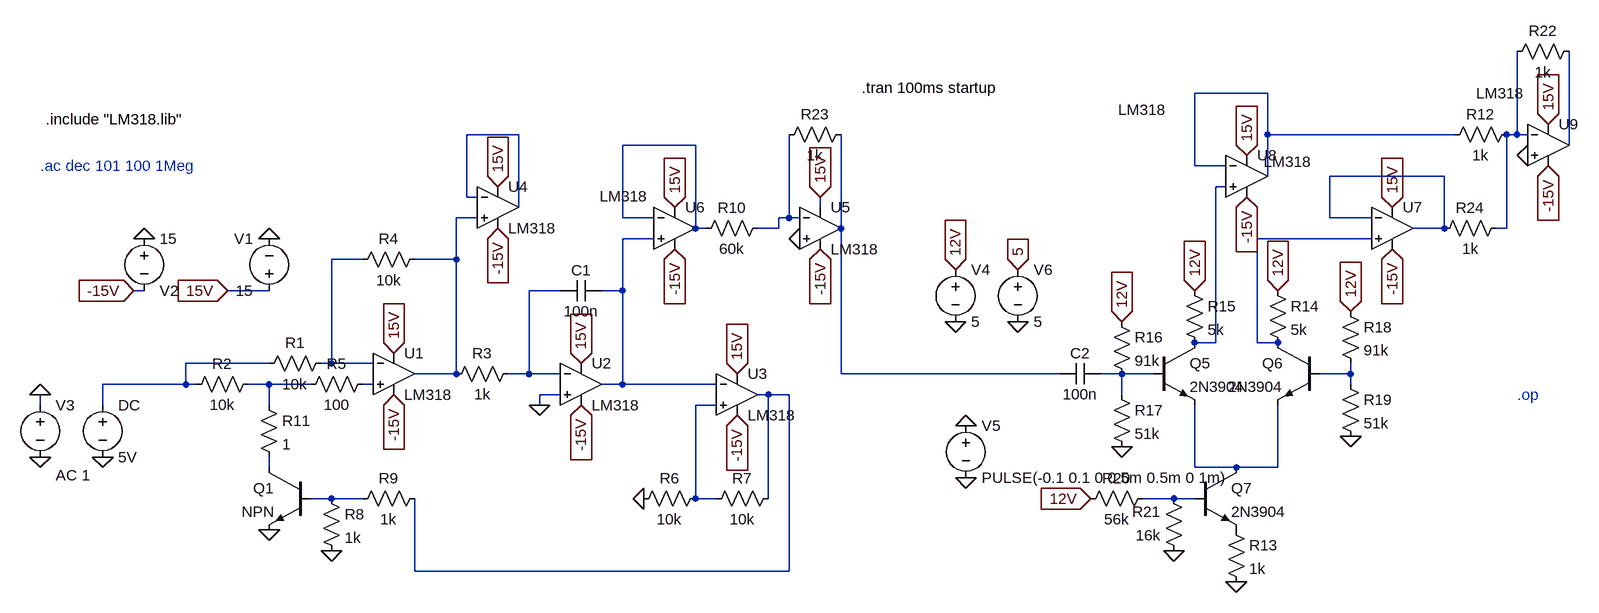
[diagram p0: schematic Draft5.asc]
Draft5.asc, the LTspice schematic file:
Version 4.1
SHEET 1 2740 720
WIRE 1472 -192 1360 -192
WIRE 320 -128 240 -128
WIRE 1472 -128 1472 -192
WIRE 1760 -128 1472 -128
WIRE 1856 -128 1856 -256
WIRE 1856 -128 1840 -128
WIRE 1872 -128 1856 -128
WIRE 592 -112 480 -112
WIRE 1936 -112 1936 -256
WIRE 1360 -80 1360 -192
WIRE 1408 -80 1360 -80
WIRE 1472 -64 1472 -128
WIRE 1744 -64 1568 -64
WIRE 1408 -48 1392 -48
WIRE 240 -32 240 -128
WIRE 256 -32 240 -32
WIRE 320 -16 320 -128
WIRE 784 -16 784 -32
WIRE 256 0 224 0
WIRE 480 0 480 -112
WIRE 528 0 480 0
WIRE 736 0 736 -128
WIRE 736 0 720 0
WIRE 752 0 736 0
WIRE 1568 0 1568 -64
WIRE 1632 0 1568 0
WIRE 592 16 592 -112
WIRE 608 16 592 16
WIRE 720 16 720 0
WIRE 720 16 688 16
WIRE 816 16 816 -128
WIRE 1744 16 1744 -64
WIRE 1744 16 1696 16
WIRE 1840 16 1840 -128
WIRE 1840 16 1824 16
WIRE 528 32 480 32
WIRE 1632 32 1456 32
WIRE 80 64 32 64
WIRE 224 64 224 0
WIRE 224 64 160 64
WIRE -256 112 -272 112
WIRE -64 112 -128 112
WIRE 384 112 336 112
WIRE 480 112 480 32
WIRE 480 112 448 112
WIRE 1392 192 1392 -48
WIRE 1392 192 1360 192
WIRE 1456 192 1456 32
WIRE 1488 192 1456 192
WIRE -64 224 -192 224
WIRE 32 224 32 64
WIRE 32 224 16 224
WIRE 96 224 32 224
WIRE 224 240 224 64
WIRE 224 240 160 240
WIRE 336 240 336 112
WIRE 336 240 304 240
WIRE 384 240 336 240
WIRE 816 240 816 16
WIRE 1152 240 816 240
WIRE 1248 240 1216 240
WIRE 1296 240 1248 240
WIRE 1600 240 1600 224
WIRE 1600 240 1552 240
WIRE -192 256 -192 224
WIRE -192 256 -320 256
WIRE -176 256 -192 256
WIRE -64 256 -96 256
WIRE 0 256 -64 256
WIRE 96 256 80 256
WIRE 480 256 480 112
WIRE 480 256 448 256
WIRE 624 256 480 256
WIRE 1600 256 1600 240
WIRE 384 272 352 272
WIRE 704 272 688 272
WIRE 736 272 704 272
WIRE 1248 272 1248 240
WIRE -416 288 -416 272
WIRE -320 288 -320 256
WIRE -64 288 -64 256
WIRE 352 288 352 272
WIRE 624 288 592 288
WIRE -64 384 -64 368
WIRE 1360 384 1360 288
WIRE 1424 384 1360 384
WIRE 1488 384 1488 288
WIRE 1488 384 1424 384
WIRE 32 432 0 432
WIRE 80 432 32 432
WIRE 592 432 592 288
WIRE 624 432 592 432
WIRE 704 432 704 272
WIRE 1328 432 1280 432
WIRE 1360 432 1328 432
WIRE 160 544 160 432
WIRE 736 544 736 272
WIRE 736 544 160 544
FLAG -128 112 15V
IOPIN -128 112 In
FLAG -272 112 -15V
IOPIN -272 112 In
FLAG -64 32 0
FLAG -256 32 0
FLAG 128 208 15V
IOPIN 128 208 In
FLAG 128 272 -15V
IOPIN 128 272 In
FLAG 416 288 -15V
IOPIN 416 288 In
FLAG 416 224 15V
IOPIN 416 224 In
FLAG 352 288 0
FLAG -64 480 0
FLAG 656 304 -15V
IOPIN 656 304 In
FLAG 512 432 0
FLAG 656 240 15V
IOPIN 656 240 In
FLAG -320 368 0
FLAG 32 512 0
FLAG -416 368 0
FLAG -416 272 0
FLAG 1424 560 0
FLAG 992 80 12V
IOPIN 992 80 In
FLAG 992 160 0
FLAG 1360 112 12V
IOPIN 1360 112 In
FLAG 1488 112 12V
IOPIN 1488 112 In
FLAG 1248 352 0
FLAG 1248 160 12V
IOPIN 1248 160 In
FLAG 1600 336 0
FLAG 1600 144 12V
IOPIN 1600 144 In
FLAG 1328 512 0
FLAG 1200 432 12V
IOPIN 1200 432 In
FLAG 1088 160 0
FLAG 752 32 0
FLAG 1088 80 5
IOPIN 1088 80 In
FLAG 560 48 -15V
IOPIN 560 48 In
FLAG 288 -48 15V
IOPIN 288 -48 In
FLAG 560 -16 15V
IOPIN 560 -16 In
FLAG 288 16 -15V
IOPIN 288 16 In
FLAG 784 48 -15V
IOPIN 784 48 In
FLAG 784 -32 15V
IOPIN 784 -32 In
FLAG 1008 400 0
FLAG 1440 -32 -15V
IOPIN 1440 -32 In
FLAG 1440 -96 15V
IOPIN 1440 -96 In
FLAG 1664 -16 15V
IOPIN 1664 -16 In
FLAG 1664 48 -15V
IOPIN 1664 48 In
FLAG 1008 320 0
FLAG 1904 -144 15V
IOPIN 1904 -144 In
FLAG 1904 -80 -15V
IOPIN 1904 -80 In
FLAG 1872 -96 0
SYMBOL OpAmps\\opamp2 128 176 R0
SYMATTR InstName U1
SYMATTR Value LM318
SYMBOL voltage -320 272 R0
SYMATTR InstName DC
SYMATTR Value 5V
SYMBOL res 32 208 R90
WINDOW 0 0 56 VBottom 2
WINDOW 3 32 56 VTop 2
SYMATTR InstName R1
SYMATTR Value 10k
SYMBOL res -80 240 R90
WINDOW 0 0 56 VBottom 2
WINDOW 3 32 56 VTop 2
SYMATTR InstName R2
SYMATTR Value 10k
SYMBOL res 176 48 R90
WINDOW 0 0 56 VBottom 2
WINDOW 3 32 56 VTop 2
SYMATTR InstName R4
SYMATTR Value 10k
SYMBOL cap 448 96 R90
WINDOW 0 0 32 VBottom 2
WINDOW 3 32 32 VTop 2
SYMATTR InstName C1
SYMATTR Value 100n
SYMBOL OpAmps\\opamp2 416 192 R0
SYMATTR InstName U2
SYMATTR Value LM318
SYMBOL res 320 224 R90
WINDOW 0 0 56 VBottom 2
WINDOW 3 32 56 VTop 2
SYMATTR InstName R3
SYMATTR Value 1k
SYMBOL voltage -64 128 R180
WINDOW 0 24 96 Left 2
WINDOW 3 24 16 Left 2
WINDOW 123 0 0 Left 0
WINDOW 39 0 0 Left 0
SYMATTR InstName V1
SYMATTR Value 15
SYMBOL voltage -256 16 R0
WINDOW 0 24 96 Left 2
WINDOW 3 24 16 Left 2
WINDOW 123 0 0 Left 0
WINDOW 39 0 0 Left 0
SYMATTR InstName V2
SYMATTR Value 15
SYMBOL res 96 240 R90
WINDOW 0 0 56 VBottom 2
WINDOW 3 32 56 VTop 2
SYMATTR InstName R5
SYMATTR Value 100
SYMBOL npn 0 384 M0
SYMATTR InstName Q1
SYMBOL OpAmps\\opamp2 656 208 R0
SYMATTR InstName U3
SYMATTR Value LM318
SYMBOL res 608 416 R90
WINDOW 0 0 56 VBottom 2
WINDOW 3 32 56 VTop 2
SYMATTR InstName R6
SYMATTR Value 10k
SYMBOL res 720 416 R90
WINDOW 0 0 56 VBottom 2
WINDOW 3 32 56 VTop 2
SYMATTR InstName R7
SYMATTR Value 10k
SYMBOL res 16 416 R0
SYMATTR InstName R8
SYMATTR Value 1k
SYMBOL res 176 416 R90
WINDOW 0 0 56 VBottom 2
WINDOW 3 32 56 VTop 2
SYMATTR InstName R9
SYMATTR Value 1k
SYMBOL voltage -416 272 R0
WINDOW 123 24 124 Left 2
WINDOW 39 0 0 Left 0
SYMATTR Value2 AC 1
SYMATTR InstName V3
SYMATTR Value ""
SYMBOL npn 1296 192 R0
SYMATTR InstName Q5
SYMATTR Value 2N3904
SYMBOL npn 1552 192 M0
SYMATTR InstName Q6
SYMATTR Value 2N3904
SYMBOL res 1408 464 R0
SYMATTR InstName R13
SYMATTR Value 1k
SYMBOL npn 1360 384 R0
SYMATTR InstName Q7
SYMATTR Value 2N3904
SYMBOL res 1472 96 R0
SYMATTR InstName R14
SYMATTR Value 5k
SYMBOL res 1344 96 R0
SYMATTR InstName R15
SYMATTR Value 5k
SYMBOL voltage 992 64 R0
WINDOW 123 0 0 Left 0
WINDOW 39 0 0 Left 0
SYMATTR InstName V4
SYMATTR Value 5
SYMBOL res 1232 144 R0
SYMATTR InstName R16
SYMATTR Value 91k
SYMBOL res 1232 256 R0
SYMATTR InstName R17
SYMATTR Value 51k
SYMBOL cap 1216 224 R90
WINDOW 0 0 32 VBottom 2
WINDOW 3 32 32 VTop 2
SYMATTR InstName C2
SYMATTR Value 100n
SYMBOL res 1584 128 R0
SYMATTR InstName R18
SYMATTR Value 91k
SYMBOL res 1584 240 R0
SYMATTR InstName R19
SYMATTR Value 51k
SYMBOL res 1296 416 R90
WINDOW 0 0 56 VBottom 2
WINDOW 3 32 56 VTop 2
SYMATTR InstName R20
SYMATTR Value 56k
SYMBOL res 1344 528 R180
WINDOW 0 36 76 Left 2
WINDOW 3 36 40 Left 2
SYMATTR InstName R21
SYMATTR Value 16k
SYMBOL voltage 1088 64 R0
SYMATTR InstName V6
SYMATTR Value 5
SYMBOL res 832 -144 R90
WINDOW 0 0 56 VBottom 2
WINDOW 3 32 56 VTop 2
SYMATTR InstName R23
SYMATTR Value 1k
SYMBOL OpAmps\\opamp2 288 -80 R0
SYMATTR InstName U4
SYMATTR Value LM318
SYMBOL OpAmps\\opamp2 784 -48 R0
SYMATTR InstName U5
SYMATTR Value LM318
SYMBOL OpAmps\\opamp2 560 -48 R0
WINDOW 3 -115 15 Left 2
SYMATTR Value LM318
SYMATTR InstName U6
SYMBOL res 704 0 R90
WINDOW 0 0 56 VBottom 2
WINDOW 3 32 56 VTop 2
SYMATTR InstName R10
SYMATTR Value 60k
SYMBOL voltage 1008 304 R0
SYMATTR InstName V5
SYMATTR Value PULSE(-0.1 0.1 0 0.5m 0.5m 0 1m)
SYMBOL OpAmps\\opamp2 1440 -128 R0
WINDOW 3 -198 -38 Left 2
SYMATTR Value LM318
SYMATTR InstName U8
SYMBOL OpAmps\\opamp2 1664 -48 R0
WINDOW 3 -198 -38 Left 2
SYMATTR Value LM318
SYMATTR InstName U7
SYMBOL res -80 272 R0
SYMATTR InstName R11
SYMATTR Value 1
SYMBOL OpAmps\\opamp2 1904 -176 R0
WINDOW 3 -111 -16 Left 2
SYMATTR Value LM318
SYMATTR InstName U9
SYMBOL res 1856 -144 R90
WINDOW 0 0 56 VBottom 2
WINDOW 3 32 56 VTop 2
SYMATTR InstName R12
SYMATTR Value 1k
SYMBOL res 1952 -272 R90
WINDOW 0 0 56 VBottom 2
WINDOW 3 32 56 VTop 2
SYMATTR InstName R22
SYMATTR Value 1k
SYMBOL res 1840 0 R90
WINDOW 0 0 56 VBottom 2
WINDOW 3 32 56 VTop 2
SYMATTR InstName R24
SYMATTR Value 1k
TEXT -408 -152 Left 2 !.include "LM318.lib"
TEXT 848 -200 Left 2 !.tran 100ms startup
TEXT -416 -80 Left 2 ;.ac dec 101 100 1Meg
TEXT 1856 272 Left 2 ;.op

The netlist it stands for:
* Draft5.asc
X§U1 N019 N013 15V -15V N008 LM318  ; pins In+ In- V+ V- OUT
V§DC N015 0 5V
R1 N013 N015 10k
R2 N018 N015 10k
R4 N008 N013 10k
C1 N011 N014 100n
X§U2 0 N014 15V -15V N011 LM318  ; pins In+ In- V+ V- OUT
R3 N014 N008 1k
V1 15V 0 15
V2 0 -15V 15
R5 N019 N018 100
Q1 N022 N024 0 0 NPN
X§U3 N021 N011 15V -15V N020 LM318  ; pins In+ In- V+ V- OUT
R6 N021 0 10k
R7 N020 N021 10k
R8 N024 0 1k
R9 N020 N024 1k
V3 0 0 AC 1
Q5 N007 N016 N023 0 2N3904
Q6 N012 N017 N023 0 2N3904
R13 P001 0 1k
Q7 N023 N025 P001 0 2N3904
R14 12V N012 5k
R15 12V N007 5k
V4 12V 0 5
R16 12V N016 91k
R17 N016 0 51k
C2 N016 N010 100n
R18 12V N017 91k
R19 N017 0 51k
R20 N025 12V 56k
R21 0 N025 16k
V6 5 0 5
R23 N010 N009 1k
X§U4 N008 N002 15V -15V N002 LM318  ; pins In+ In- V+ V- OUT
X§U5 0 N009 15V -15V N010 LM318  ; pins In+ In- V+ V- OUT
X§U6 N011 N004 15V -15V N004 LM318  ; pins In+ In- V+ V- OUT
R10 N009 N004 60k
V5 0 0 PULSE(-0.1 0.1 0 0.5m 0.5m 0 1m)
X§U8 N007 N001 15V -15V N001 LM318  ; pins In+ In- V+ V- OUT
X§U7 N012 N006 15V -15V N006 LM318  ; pins In+ In- V+ V- OUT
R11 N018 N022 1
X§U9 0 N003 15V -15V N005 LM318  ; pins In+ In- V+ V- OUT
R12 N003 N001 1k
R22 N005 N003 1k
R24 N003 N006 1k
.model NPN NPN
.model PNP PNP
.lib standard.bjt
.include "LM318.lib"
.tran 100ms startup
* .ac dec 101 100 1Meg
* .op
.backanno
.end